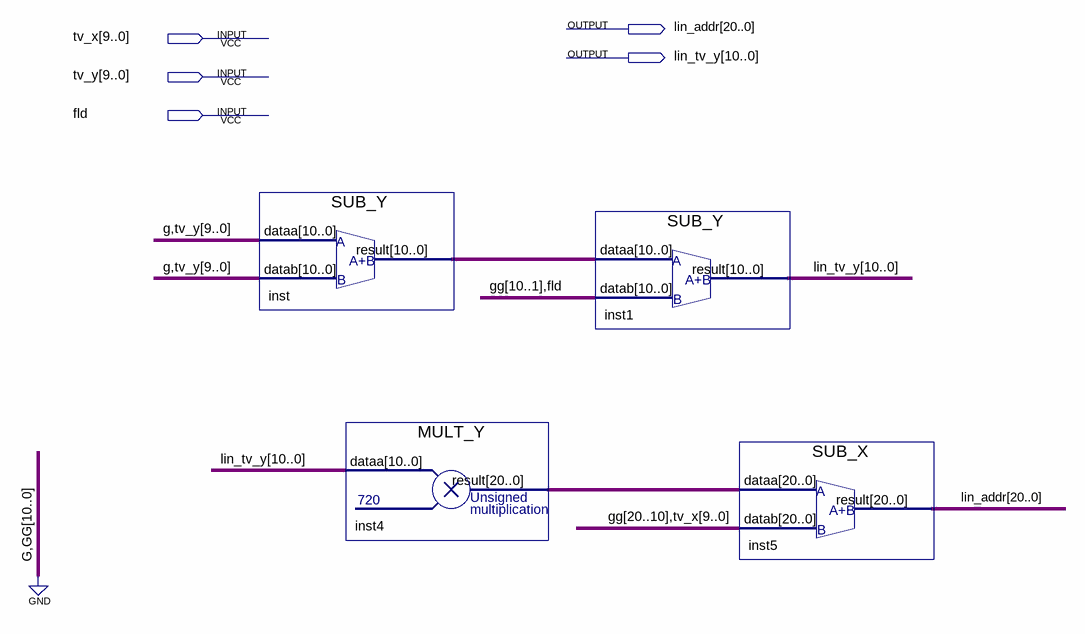
[diagram p0: schematic sheet]
// Quartus schematic TV_LIN_ADDR.bdf as structural Verilog: 4 symbols, 5 pins
module TV_LIN_ADDR (
  input  [9:0] tv_x,
  input  [9:0] tv_y,
  input  fld,
  output [20:0] lin_addr,
  output [10:0] lin_tv_y
);

  wire [10:0] inst_result;
  wire [20:0] inst4_result;
  wire [20:11] gg;

  SUB_Y inst (.dataa({1'b0, tv_y}), .datab({1'b0, tv_y}), .result(inst_result));
  MULT_Y inst4 (.dataa(lin_tv_y), .result(inst4_result));
  SUB_Y inst1 (.dataa(inst_result), .datab({{10{1'b0}}, fld}), .result(lin_tv_y));
  SUB_X inst5 (.dataa(inst4_result), .datab({gg, 1'b0, tv_x}), .result(lin_addr));
endmodule
